# EAGLE schematic TiltyOmni (EAGLE 6.5.0)
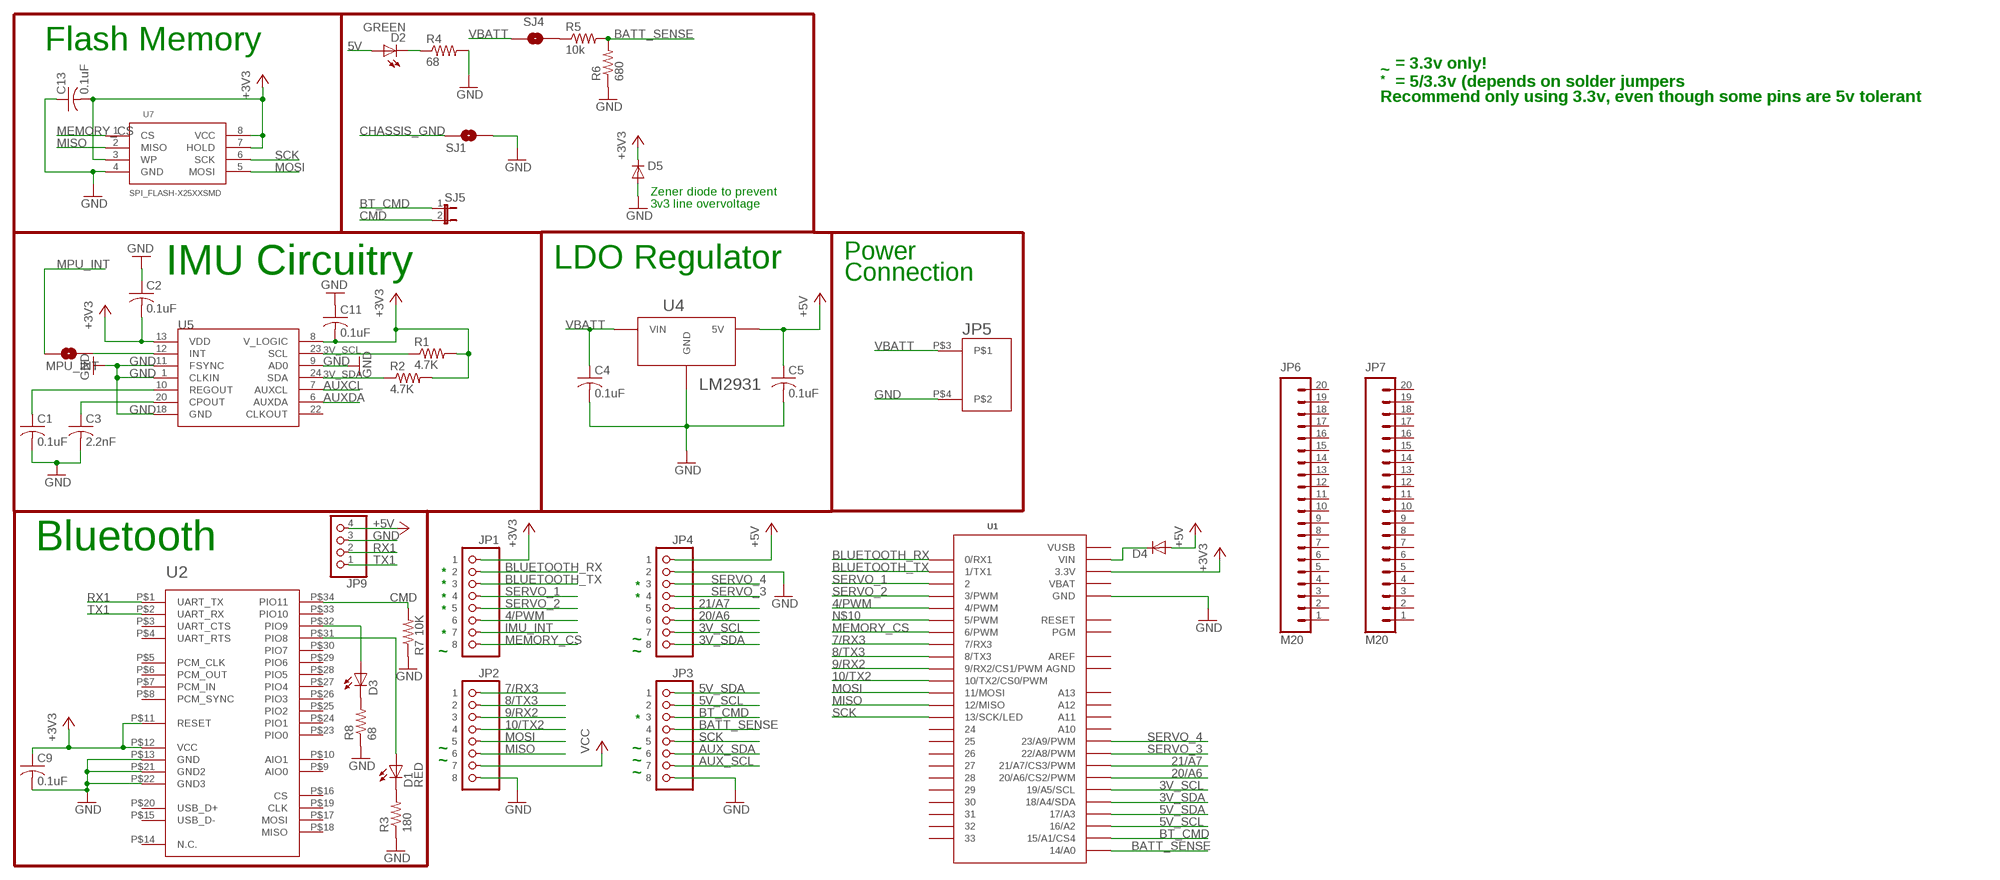
[diagram p0: schematic, sheet 1]

## Parts
C1  0.1uF  C-USC0603  [C0603]
C2  0.1uF  C-USC0603  [C0603]
C3  2.2nF  C-USC0603  [C0603]
C4  0.1uF  C-USC0603  [C0603]
C5  0.1uF  C-USC0603  [C0603]
C9  0.1uF  C-USC0603  [C0603]
C11  0.1uF  C-USC0603  [C0603]
C13  0.1uF  C-USC0603  [C0603]
D1  RED  LED-GREENLED-0805_NO_SILK  [LED-0805]
D2  GREEN  LED-GREENLED-0805_NO_SILK  [LED-0805]
D3  YELLOW  LED-GREENLED-0805_NO_SILK  [LED-0805]
D4  DIODESOT23  [SOT23-3]
D5  DIODESOT23  [SOT23-3]
JP1  8-PIN_HEADER  [8-PIN_RECEPTACLE_LOCK_NO-SS]
JP2  8-PIN_HEADER  [8-PIN_RECEPTACLE_LOCK_NO-SS]
JP3  8-PIN_HEADER  [8-PIN_RECEPTACLE_LOCK_NO-SS]
JP4  8-PIN_HEADER  [8-PIN_RECEPTACLE_LOCK_NO-SS]
JP5  2-POS_SMD_TERM_BLOCK  [2-POS_SMD_TERMINAL_BLOCK]
JP6  M20  [1X20]
JP7  M20  [1X20]
JP9  PINHD-1X41X04_NO_SS_LOCKING  [1X04_NO_SS_LOCKING]
MPU_INT  SOLDERJUMPERNO  [SJ_2S-NO]
R1  4.7K  R-US_R0603  [R0603]
R2  4.7K  R-US_R0603  [R0603]
R3  180  R-US_R0603  [R0603]
R4  68  R-US_R0603  [R0603]
R5  10k  R-US_R0603  [R0603]
R6  680  R-US_R0603  [R0603]
R7  10K  R-US_R0603  [R0603]
R8  68  R-US_R0603  [R0603]
SJ1  SOLDERJUMPERNO  [SJ_2S-NO]
SJ4  SOLDERJUMPERTRACE  [SJ_2S-TRACE]
SJ5  JUMPER-2SMD-NC  [SJ_2S]
U1  TEENSY_3.0_ALLPINS  [TEENSY_3.0_ALLPINS]
U2  HC-09_BREAKOUT  [HC-09_BREAKOUT]
U4  LM2931  [TO263]
U5  MPU-6050  [QFN-24]
U7  SPI_FLASH-X25XXSMD  [SO08]

## Nets
3V_SCL: JP4.P$7 R1.1 U1.19/A5(19/A5/SCL) U5.23(SCL)
3V_SDA: JP4.P$8 R2.1 U1.18/A4(18/A4/SDA) U5.24(SDA)
4/PWM: JP1.P$6 U1.4(4/PWM)
5V: D2.1(A)
5V_SCL: JP3.P$2 U1.16/A2
5V_SDA: JP3.P$1 U1.17/A3
7/RX3: JP2.P$1 U1.7(7/RX3)
8/TX3: JP2.P$2 U1.8(8/TX3)
9/RX2: JP2.P$3 U1.9(9/RX2/CS1/PWM)
10/TX2: JP2.P$4 U1.10(10/TX2/CS0/PWM)
20/A6: JP4.P$6 U1.20/A6(20/A6/CS2/PWM)
21/A7: JP4.P$5 U1.21/A7(21/A7/CS3/PWM)
+3V3: C2.2 C9.1 C11.2 C13.2 D5.3(C) JP1.P$1 R1.2 R2.2 U1.3.3V U1.3.3V1(3.3V) U1.3.3V2(3.3V) U2.P$11(RESET) U2.P$12(VCC) U5.8(V_LOGIC) U5.13(VDD) U7.3(WP) U7.7(HOLD) U7.8(VCC)
+5V: C5.1 D4.1(A) JP4.P$1 JP9.4 U4.P$3(5V)
AUX_SCL: JP3.P$7
AUX_SDA: JP3.P$6
AUXCL [I/O]: U5.7(AUXCL)
AUXDA [I/O]: U5.6(AUXDA)
BATT_SENSE: JP3.P$4 R5.2 R6.2 U1.14/A0
BLUETOOTH_RX: JP1.P$2 U1.0(0/RX1)
BLUETOOTH_TX: JP1.P$3 U1.1(1/TX1)
BT_CMD: JP3.P$3 SJ5.1 U1.15/A1(15/A1/CS4)
CHASSIS_GND: SJ1.1
CMD: R7.2 SJ5.2 U2.P$34(PIO11)
GND: C1.2 C2.1 C3.2 C4.2 C5.2 C9.2 C11.1 C13.1 D5.1(A) JP2.P$8 JP3.P$8 JP4.P$2 JP5.P$4 JP9.3 R3.1 R4.2 R6.1 R7.1 R8.1 SJ1.2 U1.GND U1.GND1(GND) U1.GND2(GND) U2.P$13(GND) U2.P$21(GND2) U2.P$22(GND3) U4.P$1(GND) U5.1(CLKIN) U5.9(AD0) U5.11(FSYNC) U5.18(GND) U7.4(GND)
IMU_INT: JP1.P$7
MEMORY_CS: JP1.P$8 U1.6(6/PWM) U7.1(CS)
MISO: JP2.P$6 U1.12(12/MISO) U7.2(MISO)
MOSI: JP2.P$5 U1.11(11/MOSI) U7.5(MOSI)
MPU_INT: MPU_INT.1
N$1: C1.1 U5.10(REGOUT)
N$2: C3.1 U5.20(CPOUT)
N$3: D1.2(C) R3.2
N$4: D4.3(C) U1.VIN
N$9: R5.1 SJ4.2
N$10: U1.5(5/PWM)
N$13: D2.2(C) R4.1
N$14: D1.1(A) U2.P$31(PIO8)
N$16: MPU_INT.2 U5.12(INT)
N$24: D3.2(C) R8.2
RX1: JP9.2 U2.P$1(UART_TX)
SCK: JP3.P$5 U1.13(13/SCK/LED) U7.6(SCK)
SERVO_1: JP1.P$4 U1.2
SERVO_2: JP1.P$5 U1.3(3/PWM)
SERVO_3: JP4.P$4 U1.22/A8(22/A8/PWM)
SERVO_4: JP4.P$3 U1.23/A9(23/A9/PWM)
TX1: JP9.1 U2.P$2(UART_RX)
VBATT: C4.1 JP5.P$3 SJ4.1 U4.P$2(VIN)
VCC: JP2.P$7
YEL_LED: D3.1(A) U2.P$32(PIO9)
Unconnected: JP6.1 JP6.2 JP6.3 JP6.4 JP6.5 JP6.6 JP6.7 JP6.8 JP6.9 JP6.10 JP6.11 JP6.12 JP6.13 JP6.14 JP6.15 JP6.16 JP6.17 JP6.18 JP6.19 JP6.20 JP7.1 JP7.2 JP7.3 JP7.4 JP7.5 JP7.6 JP7.7 JP7.8 JP7.9 JP7.10 JP7.11 JP7.12 JP7.13 JP7.14 JP7.15 JP7.16 JP7.17 JP7.18 JP7.19 JP7.20 U1.24 U1.25 U1.26 U1.27 U1.28 U1.29 U1.30 U1.31 U1.32 U1.33 U1.A10 U1.A11 U1.A12 U1.A13 U1.PGM U1.RESET U2.P$3(UART_CTS) U2.P$4(UART_RTS) U2.P$5(PCM_CLK) U2.P$6(PCM_OUT) U2.P$7(PCM_IN) U2.P$8(PCM_SYNC) U2.P$9(AIO0) U2.P$10(AIO1) U2.P$14(N.C.) U2.P$15(USB_D-) U2.P$16(CS) U2.P$17(MOSI) U2.P$18(MISO) U2.P$19(CLK) U2.P$20(USB_D+) U2.P$23(PIO0) U2.P$24(PIO1) U2.P$25(PIO2) U2.P$26(PIO3) U2.P$27(PIO4) U2.P$28(PIO5) U2.P$29(PIO6) U2.P$30(PIO7) U2.P$33(PIO10) U5.22(CLKOUT)

## Notes on the sheet
- Flash Memory
- = 3.3v only!
- ~
- * | = 5/3.3v (depends on solder jumpers
- Recommend only using 3.3v, even though some pins are 5v tolerant
- Zener diode to prevent
- 3v3 line overvoltage
- Power
- IMU Circuitry | LDO Regulator
- Connection
- Bluetooth
- *
- * | *
- * | *
- *
- *
- ~
- ~ | ~
- *
- ~ | ~
- ~ | ~
- ~

## Power pins joined to a net without a drawn wire
AGND: U1.AGND
AREF: U1.AREF
VBAT: U1.VBAT
VUSB: U1.VUSB

## Library data of the parts
C1 C9 C13 = resistor:C-US: CAPACITOR, American symbol; RATED_VOLTAGE: 2
C2 C4 C5 C11 = resistor:C-US: CAPACITOR, American symbol
C3 = resistor:C-US: CAPACITOR, American symbol; RATED_VOLTAGE: 50
D1-D3 = SparkFun-LED:LED-GREEN: Various green LEDs 0603- DIO-00821 LARGE- DIO-00862 LILYPAD- DIO-09910
D4 = SparkFun-DiscreteSemi:DIODE: Diode These are standard reverse protection diodes and small signal diodes. SMA package can handle up to about 1A. SOD-323 can handle about 200mA. What the SOD-323 package when ordering, there are some mfgs out there that are 5-pin packages.
D5 = SparkFun-DiscreteSemi:DIODE: Diode These are standard reverse protection diodes and small signal diodes. SMA package can handle up to about 1A. SOD-323 can handle about 200mA. What the SOD-323 package when ordering, there are some mfgs out there that are 5-pin packages.; PART#: BZX84C3V3LT1GOSCT-ND
JP1-JP4 = My Parts:8-PIN_HEADER
JP5 = My Parts:2-POS_SMD_TERM_BLOCK; PART#: 277-2337-1-ND; POSSIBLE_ALT: 009276002021106
JP6 JP7 = SparkFun-Connectors:M20: 1x20 .1" header This is just like the LOCK variant in that the holes are staggared by 5 mil, but except for the last two holes. They are not altered from the "standard" footprint layout. This is used for a special purpose on the layout of our Graphic LCD Backpack. Make sure you want to use this device before selecting it for you project!
JP9 = pinhead:PINHD-1X4: PIN HEADER
MPU_INT SJ1 SJ4 = SparkFun-Passives:SOLDERJUMPER: Solder Jumper Standard SMD solder jumper. Used to automate production. Two varients : Normally Open and Normally Closed are the same, but have different paste layers. NC will have a large amount of paste and should jumper during reflow.
R1-R8 = resistor:R-US_: RESISTOR, American symbol
SJ5 = SparkFun-Passives:JUMPER-2: Jumper Basic 0.1" spaced jumper. Use with breakaway headers.
U1 = Teensy3.0:TEENSY_3.0_ALLPINS: Teensy 3.0 with all pin holes and optional SMD-mount unshrouded header on bottom of Teensy 3.0. For more basic versions, see 'Basic', '+4' and 'AllAnalogPins'. Requires the installation of a un-shrouded SMD header on the underside of the Teensy 3.0
U2 = csr:HC-09_BREAKOUT
U4 = on-semiconductor:LM2931; COST: 0.53
U5 = SparkFun-Sensors:MPU-6050: MPU-6000 - I2C address is 0x68 with AD0 low and 0x69 with AD0 high.
U7 = SparkFun-DigitalIC:SPI_FLASH-X25XX: 8pin SPI Flash series x25xx. Works with devices like W25X32 and BR25L32; PART#: S25FL204K0TMFI043